# Altium schematic sheet Thiet_bi_giam_sat_IOT.SchDoc (part 3 of 3)
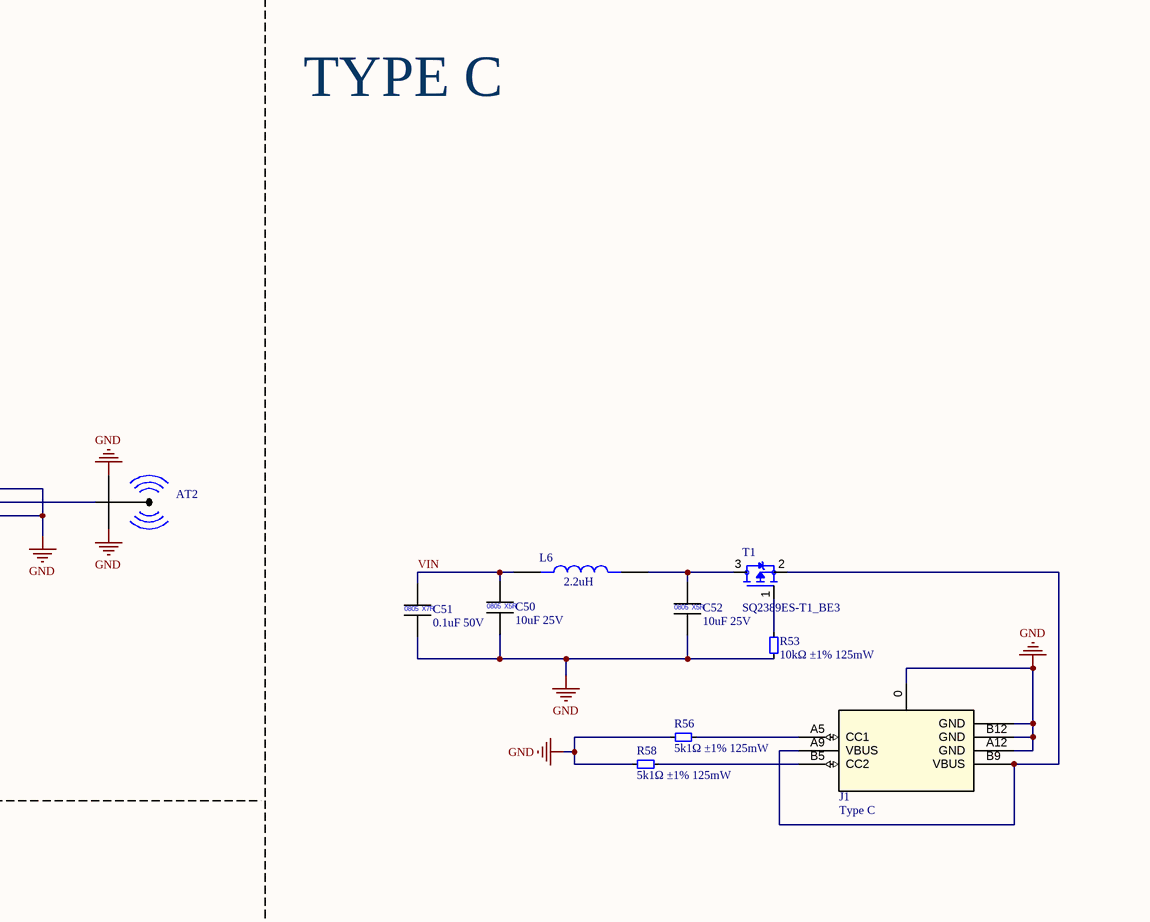
[diagram p7: Thiet_bi_giam_sat_IOT.SchDoc, bottom right]

## Library data of the parts (continued)
R7 R26 R37 = R-SM_2: 10kΩ 100mW 75V ±1% ±100ppm/℃ Thick Film Resistor 0603 Chip Resistor - Surface Mount ROHS; Manufacturer: YAGEO; Ten thuong mai: Dien tro dan 0603 ?K 1%; User: 1; Package: 0603; Mfr. Part #: *; Link VN: *; Link QT: *; ComponentLink1Description: New link; ComponentLink1URL: *
R10 R45 = RES_SMD; 47K, 1%, 0805, 1/8W: 125Mw Thick Film Resistors 100Ppm/ 1% 47K 0805 Chip Resistor Surface Mount Rohs; Manufacturer: Yageo; Manufacturer Part Number: RC0805FR-0747KL; Voltage Rating (DC): 150V; Resistance: 47kR; Temperature Coefficient: 100ppm/°C; LIBRARY MADE BY: MR. XUAN SIEU; Supplier 1: Digikey; RoHS: Yes; Category: Chip SMD Resistors; Stock 1: 133607; Pricing 1: 1=0.1, 10=0.012, 100=0.0112, 1000=0.00816 (USD); Case/Package: 0805; Number of Pins: 2; Case Code (Imperial): 0805; Case Code (Metric): 2012; Contact Plating: Tin,Matte; Size Code: 0805; Min Operating Temperature: -55°C; Max Operating Temperature: 155°C; Tolerance: 1%; Packaging: Tape and Reel; Voltage Rating: 150V; Power Rating: 125mW; Termination: SMD/SMT; Number of Terminations: 2; Voltage Rating (AC): 150V; Resistor Type: Thick Film; Features: Moisture Resistant; Max Power Dissipation: 125mW; Series: RC; Resistance Tolerance: 1%; Length: 2mm; Width: 1.25mm; Height: 0.5mm; Lead Free: 5697LeadFree; Reach SVHC Compliant: Unknown; RoHS Compliant: Yes; ComponentLink1URL: https://datasheet.ciiva.com/7941/1686128-7941799.pdf?src-supplier=Element14; ComponentLink1Description: https://datasheet.ciiva.com/7941/1686128-7941799.pdf?src-supplier=Element14; ComponentLink2URL: https://datasheet.ciiva.com/46447/444164-46447581.pdf?src-supplier=Element14; ComponentLink2Description: https://datasheet.ciiva.com/46447/444164-46447581.pdf?src-supplier=Element14; ComponentLink3URL: https://datasheet.ciiva.com/7941/444164-7941800.pdf?src-supplier=Element14; ComponentLink3Description: https://datasheet.ciiva.com/7941/444164-7941800.pdf?src-supplier=Element14; ComponentLink4URL: https://datasheet.ciiva.com/7941/444164-7941801.pdf?src-supplier=Element14; ComponentLink4Description: https://datasheet.ciiva.com/7941/444164-7941801.pdf?src-supplier=Element14; ComponentLink5URL: https://datasheet.ciiva.com/16742/rc0805-16742265.pdf?src-supplier=Future+Electronics; ComponentLink5Description: https://datasheet.ciiva.com/16742/rc0805-16742265.pdf?src-supplier=Future+Electronics; Link Viet Nam: https://linhkien.cxtvn.com/1960-dien-tro-0805-5-thong-so-tu-1k-den-91k.html; Link Original: https://www.digikey.com/en/products/detail/yageo/RC0805FR-0747KL/727973; Supplier Part Number 1: 311-47.0KCRCT-ND
R11-R13 R15 R20 R50 R51 = RES_SMD; 22R, 1%, 0805, 1/8W: SMD Chip Resistor, 22 Ohm, ± 1%, 125 mW, 0805 [2012 Metric], Thick Film, General Purpose; Manufacturer Cross: Yageo; Manufacturer Part Number: RC0805FR-0722RL; Voltage Rating (AC): 150V; LIBRARY MADE BY: MR. XUAN SIEU; Supplier 1: Digikey; RoHS: Yes; Category: Chip SMD Resistors; Stock 1: 280945; Pricing 1: 1=0.1, 10=0.012, 100=0.0112, 1000=0.00918, 5000=0.00408, 10000=0.00357, 15000=0.00355, 500000=0.00338 (USD); Lead Free: 5697LeadFree; ComponentLink1URL: https://datasheet.ciiva.com/11819/0900766b8106beab-11819837.pdf?src-supplier=Rs; ComponentLink1Description: https://datasheet.ciiva.com/11819/0900766b8106beab-11819837.pdf?src-supplier=Rs; ComponentLink2URL: https://datasheet.ciiva.com/2457/pyu-r-int-thick-7-2457045.pdf?src-supplier=Digikey; ComponentLink2Description: https://datasheet.ciiva.com/2457/pyu-r-int-thick-7-2457045.pdf?src-supplier=Digikey; ComponentLink3URL: https://datasheet.ciiva.com/2457/pyu-r-int-thick-7-2457046.pdf?src-supplier=Digikey; ComponentLink3Description: https://datasheet.ciiva.com/2457/pyu-r-int-thick-7-2457046.pdf?src-supplier=Digikey; ComponentLink4URL: https://datasheet.ciiva.com/12667/rc0805-12667371.pdf?src-supplier=Mouser; ComponentLink4Description: https://datasheet.ciiva.com/12667/rc0805-12667371.pdf?src-supplier=Mouser; ComponentLink5URL: https://datasheet.ciiva.com/2457/pyu-r-int-thick-7-2457044.pdf?src-supplier=Digikey; ComponentLink5Description: https://datasheet.ciiva.com/2457/pyu-r-int-thick-7-2457044.pdf?src-supplier=Digikey; ComponentLink6URL: https://datasheet.ciiva.com/46447/444164-46447574.pdf?src-supplier=Element14; ComponentLink6Description: https://datasheet.ciiva.com/46447/444164-46447574.pdf?src-supplier=Element14; ComponentLink7Description: Link Original; ComponentLink7URL: https://www.digikey.com/en/products/detail/yageo/RC0805FR-0722RL/727735; ComponentLink8Description: Link Cross; ComponentLink8URL: https://www.lcsc.com/product-detail/Chip-Resistor-Surface-Mount_YAGEO-RC0805FR-0722RL_C107702.html?s_z=n_RC0805FR-0722RL; ComponentLink9Description: Link Viet Nam; ComponentLink9URL: https://linhkien.cxtvn.com/10363-dien-tro-0805-1-thong-so-tu-0r-den-910r.html; Supplier Part Number 1: 311-22.0CRCT-ND
R14 R16 = RES_SMD; 2.2K, 1%, 0805, 1/8W: Res Thick Film 0805 2.2K Ohm 1% 0.125W(1/8W) ±100ppm/C Pad SMD T/R; Manufacturer Cross: TE Connectivity; Manufacturer Part Number: CRG0805F2K2; Resistance: 2.2kR; Power Rating: 125mW; Voltage Rating: 150V; Temperature Coefficient: 100ppm/°C; Number of Resistors: 1; LIBRARY MADE BY: MR. XUAN SIEU; Supplier 1: Digikey; RoHS: Yes; Category: Chip SMD Resistors; Stock 1: 293904; Pricing 1: 1=0.1, 10=0.035, 100=0.0179, 1000=0.01031, 2500=0.00862 (USD); Mount: Surface Mount; Case/Package: 0805; Case Code (Imperial): 0805; Case Code (Metric): 2012; Weight: 0.000194oz; Min Operating Temperature: -55°C; Max Operating Temperature: 125°C; Tolerance: 1%; Packaging: Tape and Reel; Resistor Type: Thick Film; Package Quantity: 5000; Termination: Solder; Number of Terminations: 2; Series: CRG; Technology: THICK FILM; Max Power Dissipation: 125mW; Voltage Rating (DC): 150V; Operating Supply Voltage: 150V; Length: 2mm; Width: 1.25mm; Height: 0.55mm; Depth: 1.25mm; ELV: Compliant; RoHS Compliant: Yes; Military Standard: Not; ComponentLink1URL: https://datasheet.ciiva.com/11809/0900766b800a696e-11809606.pdf?src-supplier=Rs; ComponentLink1Description: https://datasheet.ciiva.com/11809/0900766b800a696e-11809606.pdf?src-supplier=Rs; ComponentLink2URL: https://datasheet.ciiva.com/30142/eng-ds-1773204-e-30142790.pdf?src-supplier=Onlinecomponents.com; ComponentLink2Description: https://datasheet.ciiva.com/30142/eng-ds-1773204-e-30142790.pdf?src-supplier=Onlinecomponents.com; ComponentLink3URL: https://datasheet.ciiva.com/5547/eng-ds-1773204-g-5547934.pdf?src-supplier=Mouser; ComponentLink3Description: https://datasheet.ciiva.com/5547/eng-ds-1773204-g-5547934.pdf?src-supplier=Mouser; Supplier Part Number 1: A106060CT-ND; ComponentLink4Description: Link Original; ComponentLink4URL: https://www.digikey.com/en/products/detail/te-connectivity-passive-product/CRG0805F2K2/2135487; ComponentLink5Description: Link Cross; ComponentLink5URL: https://www.lcsc.com/product-detail/Chip-Resistor-Surface-Mount_TE-Connectivity-CRG0805F2K2_C2073912.html?s_z=n_CRG0805F2K2; ComponentLink6Description: Link Viet Nam; ComponentLink6URL: https://linhkien.cxtvn.com/5089-dien-tro-0805-1-thong-so-tu-1k-den-91k.html
R32 R47 R53 R54 R56 R58 R59 = R-SM_3: 10kΩ 100mW 75V ±1% ±100ppm/℃ Thick Film Resistor 0603 Chip Resistor - Surface Mount ROHS; Manufacturer: YAGEO; Ten thuong mai: Dien tro dan 0603 ?K 1%; User: 1; Package: 0603; Mfr. Part #: *; Link VN: *; Link QT: *; ComponentLink1Description: New link; ComponentLink1URL: *
R43 = RES_SMD; 100K, 1%, 0805, 1/8W: SMD Chip Resistor, 100 kOhm, ï¿½ 1%, 125 mW, 0805 [2012 Metric], Thick Film, General Purpose; Manufacturer Cross: Yageo; Manufacturer Part Number: RC0805FR-07100KL; Resistance: 100kR; Power Rating: 125mW; Voltage Rating: 150V; Temperature Coefficient: 100ppm/°C; LIBRARY MADE BY: MR. XUAN SIEU; Supplier 1: Digikey; RoHS: Yes; Category: Chip SMD Resistors; Stock 1: 541448; Pricing 1: 1=0.1, 10=0.014, 100=0.0112, 1000=0.00918 (USD); Case/Package: 0805; Number of Pins: 2; Case Code (Metric): 2012; Case Code (Imperial): 0805; Size Code: 0805; Min Operating Temperature: -55°C; Max Operating Temperature: 155°C; Tolerance: 1%; Package Quantity: 1; Packaging: Tape and Reel; Resistor Type: Thick Film; Number of Terminations: 2; Termination: SMD/SMT; Max Power Dissipation: 125mW; Features: Moisture Resistant; Series: RC; Construction: Rectangular; Resistance Tolerance: 1%; Voltage Rating (AC): 150V; Voltage Rating (DC): 150V; Technology: THICK FILM; Length: 0.079inch; Width: 0.049inch; Height: 0.024inch; Depth: 1.25mm; Lead Pitch: 0.4mm; Military Standard: Not; RoHS Compliant: Yes; Reach SVHC Compliant: Unknown; Lead Free: 5697LeadFree; ComponentLink1URL: https://datasheet.ciiva.com/11808/0900766b8106beab-11808858.pdf?src-supplier=Rs; ComponentLink1Description: https://datasheet.ciiva.com/11808/0900766b8106beab-11808858.pdf?src-supplier=Rs; ComponentLink2URL: https://datasheet.ciiva.com/7941/1686128-7941677.pdf?src-supplier=Element14; ComponentLink2Description: https://datasheet.ciiva.com/7941/1686128-7941677.pdf?src-supplier=Element14; ComponentLink3URL: https://datasheet.ciiva.com/7660/38627-7660796.pdf?src-supplier=Element14; ComponentLink3Description: https://datasheet.ciiva.com/7660/38627-7660796.pdf?src-supplier=Element14; ComponentLink4URL: https://datasheet.ciiva.com/22747/444164-22747534.pdf?src-supplier=Element14; ComponentLink4Description: https://datasheet.ciiva.com/22747/444164-22747534.pdf?src-supplier=Element14; ComponentLink5URL: https://datasheet.ciiva.com/2457/pyu-r-int-thick-7-2457018.pdf?src-supplier=Digikey; ComponentLink5Description: https://datasheet.ciiva.com/2457/pyu-r-int-thick-7-2457018.pdf?src-supplier=Digikey; ComponentLink6URL: https://datasheet.ciiva.com/2457/pyu-r-int-thick-7-2457019.pdf?src-supplier=Digikey; ComponentLink6Description: https://datasheet.ciiva.com/2457/pyu-r-int-thick-7-2457019.pdf?src-supplier=Digikey; ComponentLink7URL: https://datasheet.ciiva.com/2457/pyu-r-int-thick-7-2457017.pdf?src-supplier=Digikey; ComponentLink7Description: https://datasheet.ciiva.com/2457/pyu-r-int-thick-7-2457017.pdf?src-supplier=Digikey; ComponentLink8URL: https://datasheet.ciiva.com/12667/rc0805-12667001.pdf?src-supplier=Mouser; ComponentLink8Description: https://datasheet.ciiva.com/12667/rc0805-12667001.pdf?src-supplier=Mouser; ComponentLink9URL: https://datasheet.ciiva.com/7941/1697719-7941676.pdf?src-supplier=Element14; ComponentLink9Description: https://datasheet.ciiva.com/7941/1697719-7941676.pdf?src-supplier=Element14; ComponentLink10URL: https://datasheet.ciiva.com/7941/1697719-7941678.pdf?src-supplier=Element14; ComponentLink10Description: https://datasheet.ciiva.com/7941/1697719-7941678.pdf?src-supplier=Element14; ComponentLink11URL: https://datasheet.ciiva.com/16747/rc0805-16747226.pdf?src-supplier=Future+Electronics; ComponentLink11Description: https://datasheet.ciiva.com/16747/rc0805-16747226.pdf?src-supplier=Future+Electronics; Supplier Part Number 1: 311-100KCRCT-ND; ComponentLink12Description: Link Original; ComponentLink12URL: https://www.digikey.com/en/products/detail/yageo/RC0805FR-07100KL/727544; ComponentLink13Description: Link Cross; ComponentLink13URL: https://www.lcsc.com/product-detail/Chip-Resistor-Surface-Mount_YAGEO-RC0805FR-07100KL_C96346.html?s_z=n_RC0805FR-07100KL; ComponentLink14Description: Link Viet Nam; ComponentLink14URL: https://linhkien.cxtvn.com/10639-dien-tro-0805-1-thong-so-tu-100k-den-910k.html
R44 = RES_SMD; 330R, 1%, 0805, 1/8W: Res Thick Film 0805 330 Ohm 1% 0.125W ±100ppm/°C Molded SMD Paper T/R; Manufacturer: Stackpole Electronics; Manufacturer Part Number: RMCF0805FT330R; LIBRARY MADE BY: MR. XUAN SIEU; Supplier 1: Digikey; RoHS: Yes; Category: Chip SMD Resistors; Stock 1: 325760; Pricing 1: 1=0.1, 10=0.02, 50=0.0124, 100=0.0103, 500=0.007, 1000=0.00601 (USD); ComponentLink1URL: http://components.arrow.com/part/dataview/40963487S9848862N1174?src-supplier=Arrow+Electronics; ComponentLink1Description: http://components.arrow.com/part/dataview/40963487S9848862N1174?src-supplier=Arrow+Electronics; ComponentLink2URL: https://datasheet.octopart.com/RMCF0805FT330R-Stackpole-Electronics-datasheet-12534581.pdf?src-supplier=Future+Electronics; ComponentLink2Description: https://datasheet.octopart.com/RMCF0805FT330R-Stackpole-Electronics-datasheet-12534581.pdf?src-supplier=Future+Electronics; ComponentLink3URL: https://www.verical.com/server-webapp/html/getDatasheet?partID=559884&src-supplier=Verical; ComponentLink3Description: https://www.verical.com/server-webapp/html/getDatasheet?partID=559884&src-supplier=Verical; ComponentLink4URL: https://www.seielect.com/Catalog/SEI-RMCF_RMCP.pdf?src-supplier=Digikey; ComponentLink4Description: https://www.seielect.com/Catalog/SEI-RMCF_RMCP.pdf?src-supplier=Digikey; ComponentLink5URL: https://www.seielect.com/catalog/SEI-RMCF_RMCP.pdf?src-supplier=Avnet; ComponentLink5Description: https://www.seielect.com/catalog/SEI-RMCF_RMCP.pdf?src-supplier=Avnet; ComponentLink6URL: https://www.seielect.com/catalog/SEI-Packaging.pdf?src-supplier=Digikey; ComponentLink6Description: https://www.seielect.com/catalog/SEI-Packaging.pdf?src-supplier=Digikey; Supplier Part Number 1: RMCF0805FT330RCT-ND; LINK VIET NAM: https://linhkien.cxtvn.com/2743-dien-tro-330r-0805-1-50c.html; LINK ORIGINAL: https://www.digikey.com/en/products/detail/stackpole-electronics-inc/RMCF0805FT330R/1760484?s=N4IgTCBcDaIEoFkDCAxADADjQVhQFQGYC04QBdAXyA
R48 = RES_SMD; 10K, 1%, 0805, 1/8W: SMD Chip Resistor, 10 kOhm, ± 1%, 125 mW, 0805 [2012 Metric], Thick Film, General Purpose; Manufacturer Cross: Stackpole Electronics; Manufacturer Part Number: RMCF0805FT10K0; Voltage Rating: 150V; LIBRARY MADE BY: MR. XUAN SIEU; Supplier 1: Digikey; RoHS: Yes; Category: Chip SMD Resistors; Stock 1: 1959497; Pricing 1: 1=0.1, 10=0.02, 50=0.0124, 100=0.0103, 500=0.007, 1000=0.00601 (USD); Lead Free: 5697LeadFree; ComponentLink1URL: https://datasheet.ciiva.com/15193/getdatasheetpartid-362046-15193525.pdf?src-supplier=Verical; ComponentLink1Description: https://datasheet.ciiva.com/15193/getdatasheetpartid-362046-15193525.pdf?src-supplier=Verical; Supplier Part Number 1: RMCF0805FT10K0CT-ND; ComponentLink2Description: Link Original; ComponentLink2URL: https://www.digikey.com/en/products/detail/stackpole-electronics-inc/RMCF0805FT10K0/1760676; ComponentLink3Description: Link Cross; ComponentLink3URL: https://www.lcsc.com/product-detail/Chip-Resistor-Surface-Mount_SEI-Stackpole-Elec-RMCF0805FT10K0_C237755.html; ComponentLink4Description: Link Viet Nam; ComponentLink4URL: https://linhkien.cxt.vn/8484-rc0805fr-0710kl-res-10k-ohm-1-18w-0805.html
S1 = SW-SPST: Single-Pole, Single-Throw Switch; Published: 24-Mar-1999; LatestRevisionDate: 17-Jul-2002; LatestRevisionNote: Re-released for DXP Platform.; PackageReference: SPST-2; Publisher: Altium Limited; PackageDescription: Switch; 2 Leads
T1 = SQ2389ES-T1_BE3: MOSFET, P-CH, 40V, 4.1A, SOT-23; Transistor Polarity:P Channel; Drain Source Voltage Vds:40V; Continuous Drain Current Id:4.1A; On Resistance Rds(on):0.084ohm; Transistor Mounting:Surface Mount; Rds(on) Test Voltage Vgs:10V; MF: Vishay; Package: SOT-23 Vishay; Price: None; Check_prices: https://www.snapeda.com/parts/SQ2389ES-T1_BE3/Vishay/view-part/?ref=eda; Value: *; SnapEDA_Link: https://www.snapeda.com/parts/SQ2389ES-T1_BE3/Vishay/view-part/?ref=snap; MP: SQ2389ES-T1_BE3; Availability: In Stock; Purchase-URL: https://pricing.snapeda.com/search?q=SQ2389ES-T1_BE3&ref=eda
U1 U2 U4 = LMR16006XDDCR: SIMPLE SWITCHERÂ® 4V to 60V, 600mA Step-Down Regulator with Low Iq
U5 = MCU ESP32;SMD;: MCU ESP32;ESP32-WROOM-32D;SMD;Bluetooth, WiFi 802.11b/g/n, Bluetooth v4.2 +EDR, Class 1, 2 and 3 Transceiver Module 2.4GHz ~ 2.5GHz Integrated; Manufacturer: Espressif Systems; Value: NA; Library Make By: Minh Reus; Package: Module Espressif Systems; Manufacturer Part Number: ESP32-WROOM-32D; Link: https://www.snapeda.com/parts/ESP32-WROOM-32D/Espressif+Systems/view-part/?ref=snap; Manufacture Cross: Espressif Systems; Manufacture Part Number Cross: ESP32-WROOM-32D; Price: 2.5 USD; ComponentLink1Description: Link Datasheet; ComponentLink1URL: https://www.mouser.vn/datasheet/2/891/esp32_wroom_32e_esp32_wroom_32ue_datasheet_en-1855879.pdf; ComponentLink2Description: Link Cross; ComponentLink2URL: https://www.mouser.vn/ProductDetail/Espressif-Systems/ESP32-WROOM-32E-N4?qs=Li%252BoUPsLEnsPzTWsi%252BRMgQ%3D%3D&mgh=1&utm_id=21163026226&gad_source=1&gclid=Cj0KCQjwr9m3BhDHARIsANut04b_AQEnnUKLJX941aYU4cZTQZDF0CbXrgu4UIkSqAsB6H5IRzL5HQkaAkOHEALw_wcB; ComponentLink3Description: Link Original; ComponentLink3URL: https://www.mouser.vn/ProductDetail/Espressif-Systems/ESP32-WROOM-32E-N4?qs=Li%252BoUPsLEnsPzTWsi%252BRMgQ%3D%3D&mgh=1&utm_id=21163026226&gad_source=1&gclid=Cj0KCQjwr9m3BhDHARIsANut04b_AQEnnUKLJX941aYU4cZTQZDF0CbXrgu4UIkSqAsB6H5IRzL5HQkaAkOHEALw_wcB
U7 = MCU_LORA;SMD;RA-01H: General ISM < 1GHz LoRa™ Transceiver Module 803MHz ~ 930MHz Antenna Not Included Surface Mount; Manufacturer: Ai-Thinker; Library Make By: Minh Reus; Package: SMD; Price: 10.67 USD; Manufacturer Part Number Cross: RA-01H; Value: VCC = 3.3V; Manufacture Cross: Ai-Thinker; Link: https://www.digikey.com/en/products/detail/ai-thinker/RA-01H/16688885; ComponentLink1Description: Link Datasheet; ComponentLink1URL: https://docs.ai-thinker.com/_media/lora/docs/ra-01h_product_specification_en.pdf; ComponentLink2Description: Link Original; ComponentLink2URL: https://www.digikey.com/en/products/detail/ai-thinker/RA-01H/16688885; ComponentLink3Description: Link Cross; ComponentLink3URL: https://www.digikey.com/en/products/detail/ai-thinker/RA-01H/16688885